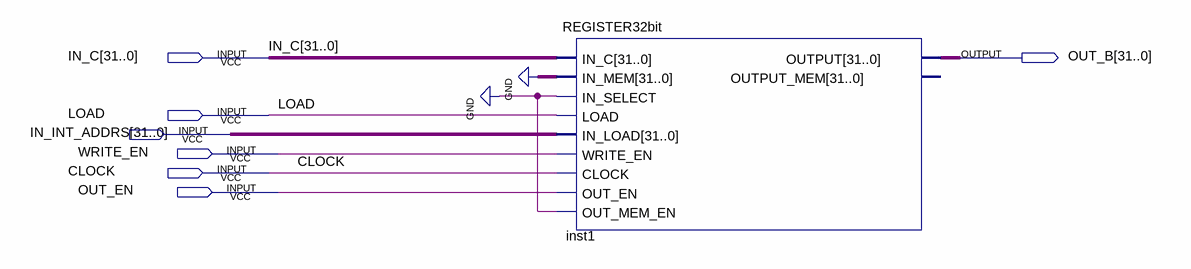
[diagram p0: schematic sheet]
// Quartus schematic LV.bdf as structural Verilog: 1 symbols, 7 pins
module LV (
  input  [31:0] IN_C,
  input  LOAD,
  input  [31:0] IN_INT_ADDRS,
  input  WRITE_EN,
  input  CLOCK,
  input  OUT_EN,
  output [31:0] OUT_B
);

  REGISTER32bit inst1 (
    .IN_C(IN_C), .IN_MEM({32{1'b0}}), .IN_SELECT(1'b0), .LOAD(LOAD), .IN_LOAD(IN_INT_ADDRS),
    .WRITE_EN(WRITE_EN), .CLOCK(CLOCK), .OUT_EN(OUT_EN), .OUT_MEM_EN(1'b0), .OUTPUT(OUT_B));  // open: OUTPUT_MEM
endmodule
